# Altium schematic sheet IR emit recv.SchDoc
size A4
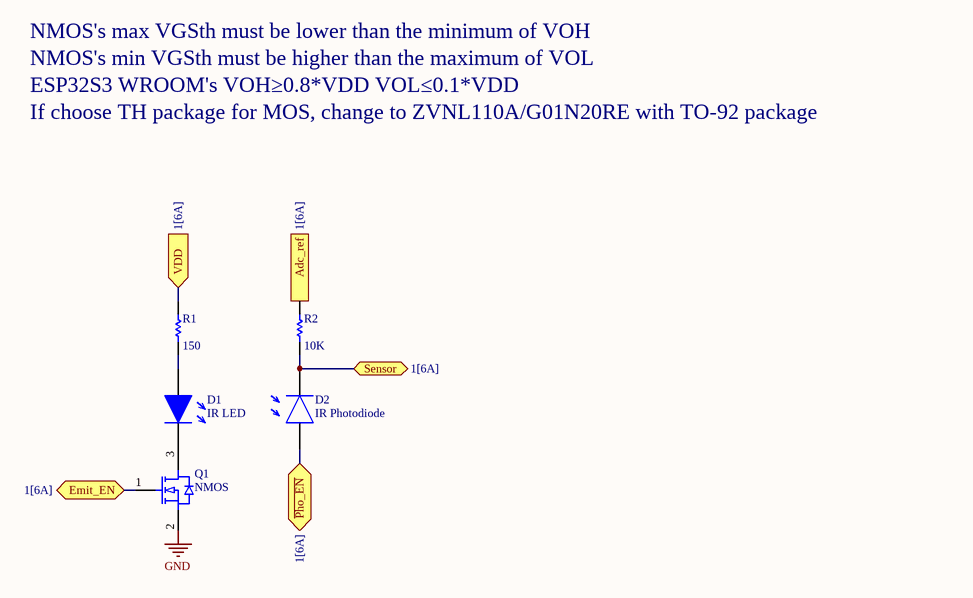
[diagram p0: IR emit recv.SchDoc]

## Parts
D1  IR LED  [LED 3mm LH THT Clear]
D2  IR Photodiode  [LED 3mm RH THT IRBlack]
Q1  NMOS  [SOT23-3]
R1  value 150  [0805 R/L]  (hidden comment: Res)
R2  value 10K  [0805 R/L]  (hidden comment: Res)

## Ports
Adc_ref (in, see 1[6A]), Emit_EN (bidir, see 1[6A]), Sensor (bidir, see 1[6A]), VDD (in, see 1[6A]), ~{Pho_EN} (bidir, see 1[6A])

## Nets
GND: Q1.2(S)
Adc_ref: R2.2 ; port Adc_ref
Emit_EN: Q1.1(G) ; port Emit_EN
~{Pho_EN}: D2.2 ; port ~{Pho_EN}
Sensor: D2.1 R2.1 ; port Sensor
VDD: R1.2 ; port VDD
NetD1_1: D1.1 Q1.3(D)
NetD1_2: D1.2 R1.1

## Notes on the sheet
- NMOS's max VGSth must be lower than the minimum of VOH
- NMOS's min VGSth must be higher than the maximum of VOL
- ESP32S3 WROOM's VOH≥0.8*VDD VOL≤0.1*VDD
- If choose TH package for MOS, change to ZVNL110A/G01N20RE with TO-92 package

## Library data of the parts
D1 = LED: 发光二极管